# Altium schematic sheet 05.SchDoc
size 297 x 209 mm
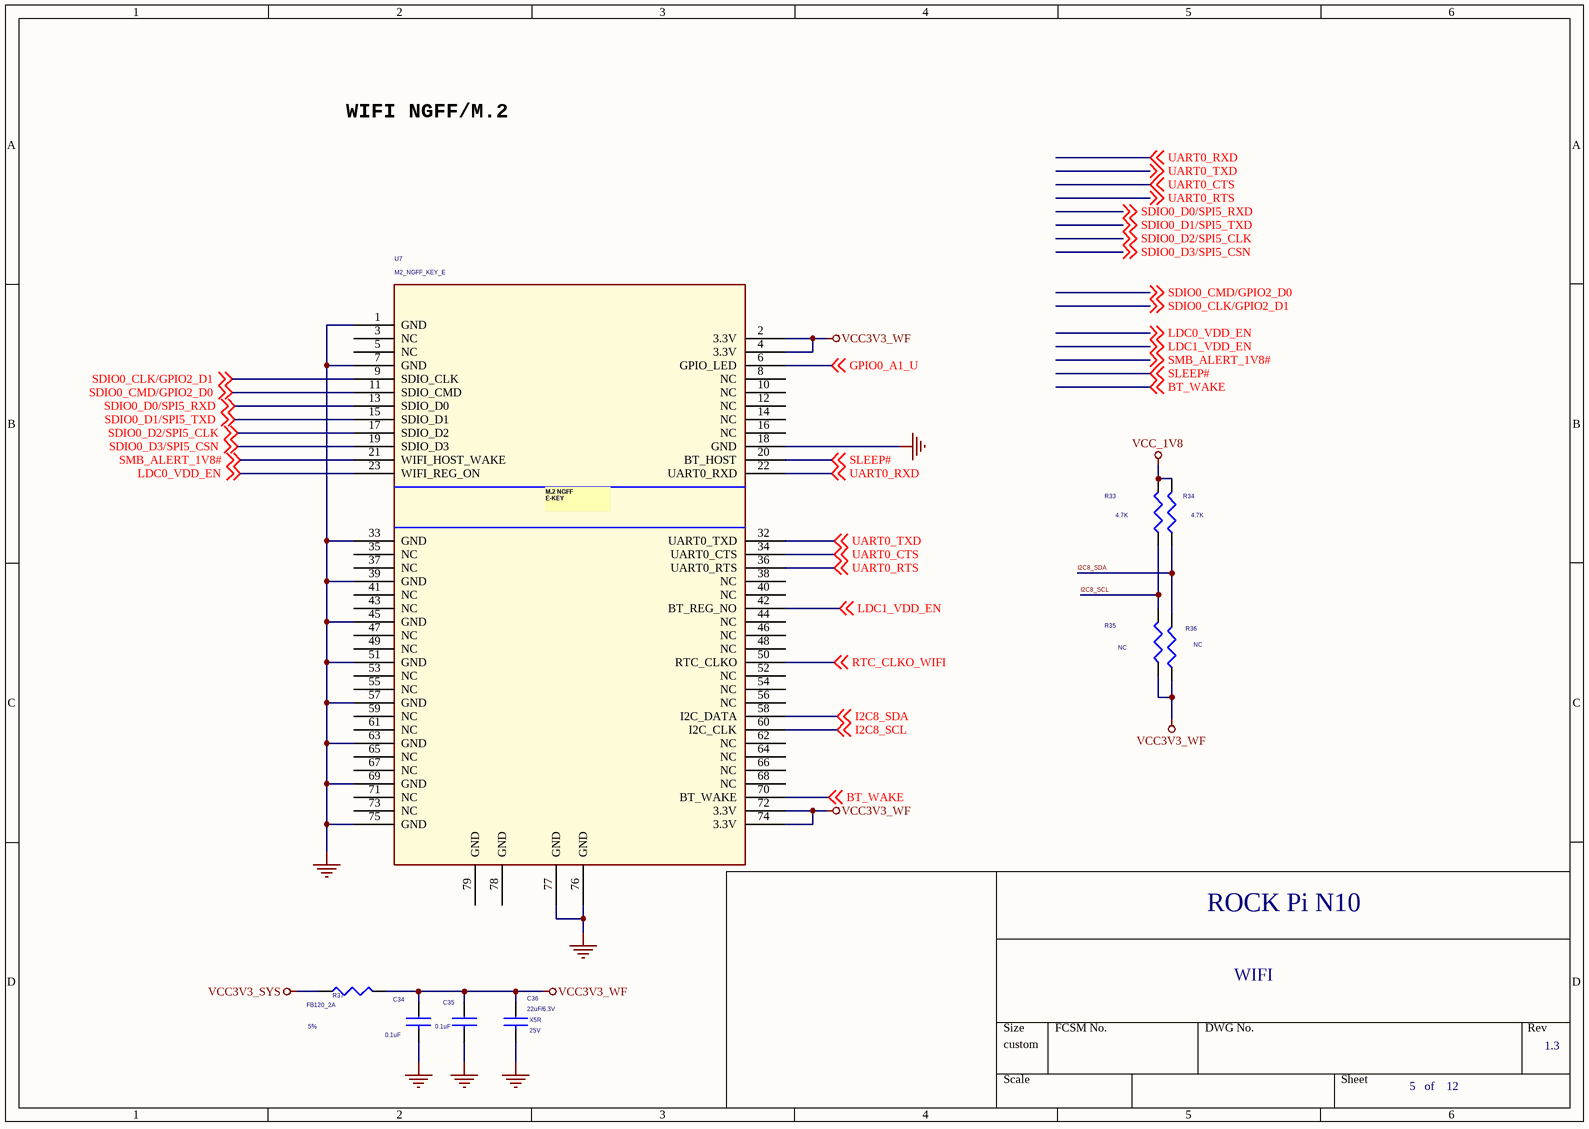
[diagram p0: 05.SchDoc]

## Parts
C34  0.1uF  [C0402]
C35  0.1uF  [C0402]
C36  22uF/6.3V  Dielectric: X5R  Voltage: 25V  [C0805]
R33  4.7K  [R0402]
R34  4.7K  [R0402]
R35  NC  [R0402]
R36  NC  [R0402]
R37  FB120_2A  Tolerance: 5%  [R0402]
U7  M2_NGFF_KEY_E  [M2_NGFF_KEY_E]

## Nets
GND: C34.2 C35.2 C36.2 U7.1(GND) U7.7(GND) U7.18(GND) U7.33(GND) U7.39(GND) U7.45(GND) U7.51(GND) U7.57(GND) U7.63(GND) U7.69(GND) U7.75(GND) U7.76(GND) U7.77(GND)
VCC3V3_SYS: R37.1
VCC3V3_WF: C34.1 C35.1 C36.1 R35.1 R36.1 R37.2 U7.2(3.3V) U7.4(3.3V) U7.72(3.3V) U7.74(3.3V)
VCC_1V8: R33.2 R34.2
BT_WAKE: U7.70(BT_WAKE) ; off-sheet BT_WAKE
GPIO0_A1_U: U7.6(GPIO_LED) ; off-sheet GPIO0_A1_U
I2C8_SCL: R33.1 R35.2 U7.60(I2C_CLK) ; off-sheet I2C8_SCL
I2C8_SDA: R34.1 R36.2 U7.58(I2C_DATA) ; off-sheet I2C8_SDA
LDC0_VDD_EN: U7.23(WIFI_REG_ON) ; off-sheet LDC0_VDD_EN
LDC1_VDD_EN: U7.42(BT_REG_NO) ; off-sheet LDC1_VDD_EN
RTC_CLKO_WIFI: U7.50(RTC_CLKO) ; off-sheet RTC_CLKO_WIFI
SDIO0_CLK/GPIO2_D1: U7.9(SDIO_CLK) ; off-sheet SDIO0_CLK/GPIO2_D1
SDIO0_CMD/GPIO2_D0: U7.11(SDIO_CMD) ; off-sheet SDIO0_CMD/GPIO2_D0
SDIO0_D0/SPI5_RXD: U7.13(SDIO_D0) ; off-sheet SDIO0_D0/SPI5_RXD
SDIO0_D1/SPI5_TXD: U7.15(SDIO_D1) ; off-sheet SDIO0_D1/SPI5_TXD
SDIO0_D2/SPI5_CLK: U7.17(SDIO_D2) ; off-sheet SDIO0_D2/SPI5_CLK
SDIO0_D3/SPI5_CSN: U7.19(SDIO_D3) ; off-sheet SDIO0_D3/SPI5_CSN
SLEEP#: U7.20(BT_HOST) ; off-sheet SLEEP#
SMB_ALERT_1V8#: U7.21(WIFI_HOST_WAKE) ; off-sheet SMB_ALERT_1V8#
UART0_CTS: U7.34(UART0_CTS) ; off-sheet UART0_CTS
UART0_RTS: U7.36(UART0_RTS) ; off-sheet UART0_RTS
UART0_RXD: U7.22(UART0_RXD) ; off-sheet UART0_RXD
UART0_TXD: U7.32(UART0_TXD) ; off-sheet UART0_TXD

Not connected (* = marked no-connect by the designer): U7 3(NC) 5(NC) 8(NC) 10(NC) 12(NC) 14(NC) 16(NC) 35(NC) 37(NC) 38(NC) 40(NC) 41(NC) 43(NC) 44(NC) 46(NC) 47(NC) 48(NC) 49(NC) 52(NC) 53(NC) 54(NC) 55(NC) 56(NC) 59(NC) 61(NC) 62(NC) 64(NC) 65(NC) 66(NC) 67(NC) 68(NC) 71(NC) 73(NC) 78(GND) 79(GND)

## Notes on the sheet
- WIFI NGFF/M.2
- ROCK Pi N10
- WIFI
- 1.3
- 5   of    12
- (in symbol M_2.2 NGFF EKEY SOCKET) M.2 NGFF / E-KEY

## Library data of the parts
C34 C35 = CAP NP_2: cap,100.00nF,+/-10%,6.3V,X5R,C0402; Manufacturer: TDK; Voltage: 16V; RK PN: C1005X5R0J104K050BA; Priority: A; Tolerance: 10%; Dielectric: X5R; Part Type: C0402; Manufacturer PN: C1005X5R0J104K050BA; Created by: JJJ
C36 = CAP NP_2: cap,4.70uF,+/-10%,6.3V,X5R,C0603; Manufacturer PN: C1608X5R0J475K080AB; Manufacturer: TDK; Tolerance: 10%; Priority: A; Created by: JJJ; Part Type: C0603; RK PN: C1608X5R0J475K080AB
R33-R36 = R_2
R37 = RESISTOR_3: 通用厚膜电阻,10K,+/-5%,R0402,1/16W.; Manufacturer PN: RC0402JR-0710KL; Manufacturer: YAGEO; Wattage: 1/16W; Priority: A; Created by: YTL; Part Type: R0603; RK PN: RC0402JR-0710KL
U7 = M_2.2 NGFF EKEY SOCKET